# EAGLE schematic Tugas arduino sensor (EAGLE 9.6.2)
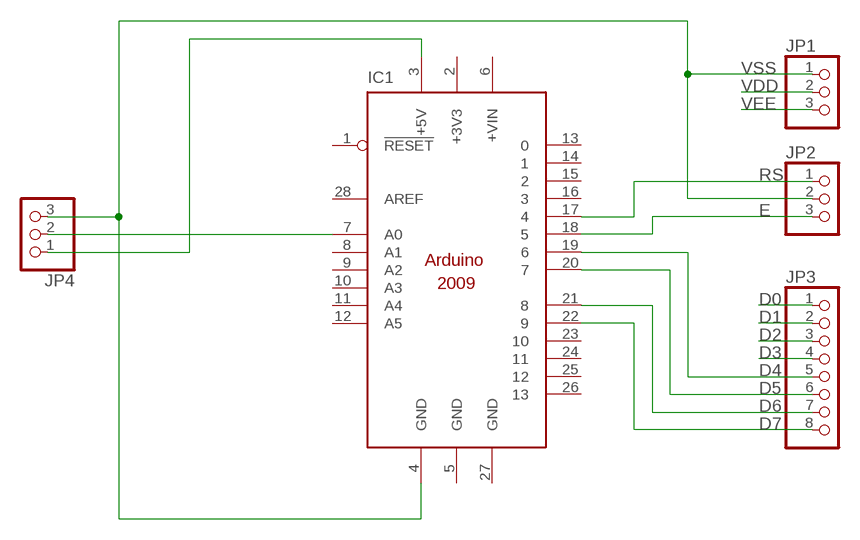
[diagram p0: schematic, sheet 1]

## Parts
IC1  ARDUINO2009_12  [ARDUINO2009_2]
JP1  PINHD-1X3  [1X03]
JP2  PINHD-1X3  [1X03]
JP3  PINHD-1X8  [1X08]
JP4  PINHD-1X3  [1X03]

## Nets
D0: JP3.1
D1: JP3.2
D2: JP3.3
D3: JP3.4
D4: IC1.19 JP3.5
D5: IC1.20 JP3.6
D6: IC1.21 JP3.7
D7: IC1.22 JP3.8
E: IC1.18 JP2.3
N$1: IC1.7(A0) JP4.2
N$2: IC1.3(+5V) JP4.1
RS: IC1.17 JP2.1
VDD: JP1.2
VEE: JP1.3
VSS: IC1.4(GND) JP1.1 JP2.2 JP4.3
Unconnected: IC1.1(!RESET) IC1.6(+VIN) IC1.8(A1) IC1.9(A2) IC1.10(A3) IC1.11(A4) IC1.12(A5) IC1.13 IC1.14 IC1.15 IC1.16 IC1.23 IC1.24 IC1.25 IC1.26 IC1.28(AREF)

## Power pins joined to a net without a drawn wire
+3V3: IC1.2(+3V3)
GND: IC1.5(GND) IC1.27(GND)

## Library data of the parts
IC1 = arduino:ARDUINO2009_1: The Arduino Duemilanove ("2009") is a microcontroller board based on the ATmega168 or ATmega328. - 14 digital input/output pins (of which 6 can be used as PWM outputs) - 6 analog inputs, a 16 MHz crystal oscillator - USB connection - power jack - ISP header - reset button It contains everything needed to support the microcontroller; simply connect it to a computer with a USB cable or power it with a AC-to-DC adapter or battery to get started http://arduino.cc/en/Main/ArduinoBoardDuemilanove
JP1 JP2 JP4 = pinhead:PINHD-1X3: PIN HEADER
JP3 = pinhead:PINHD-1X8: PIN HEADER